# EAGLE design Main-v1.0 (EAGLE 8.3.0)
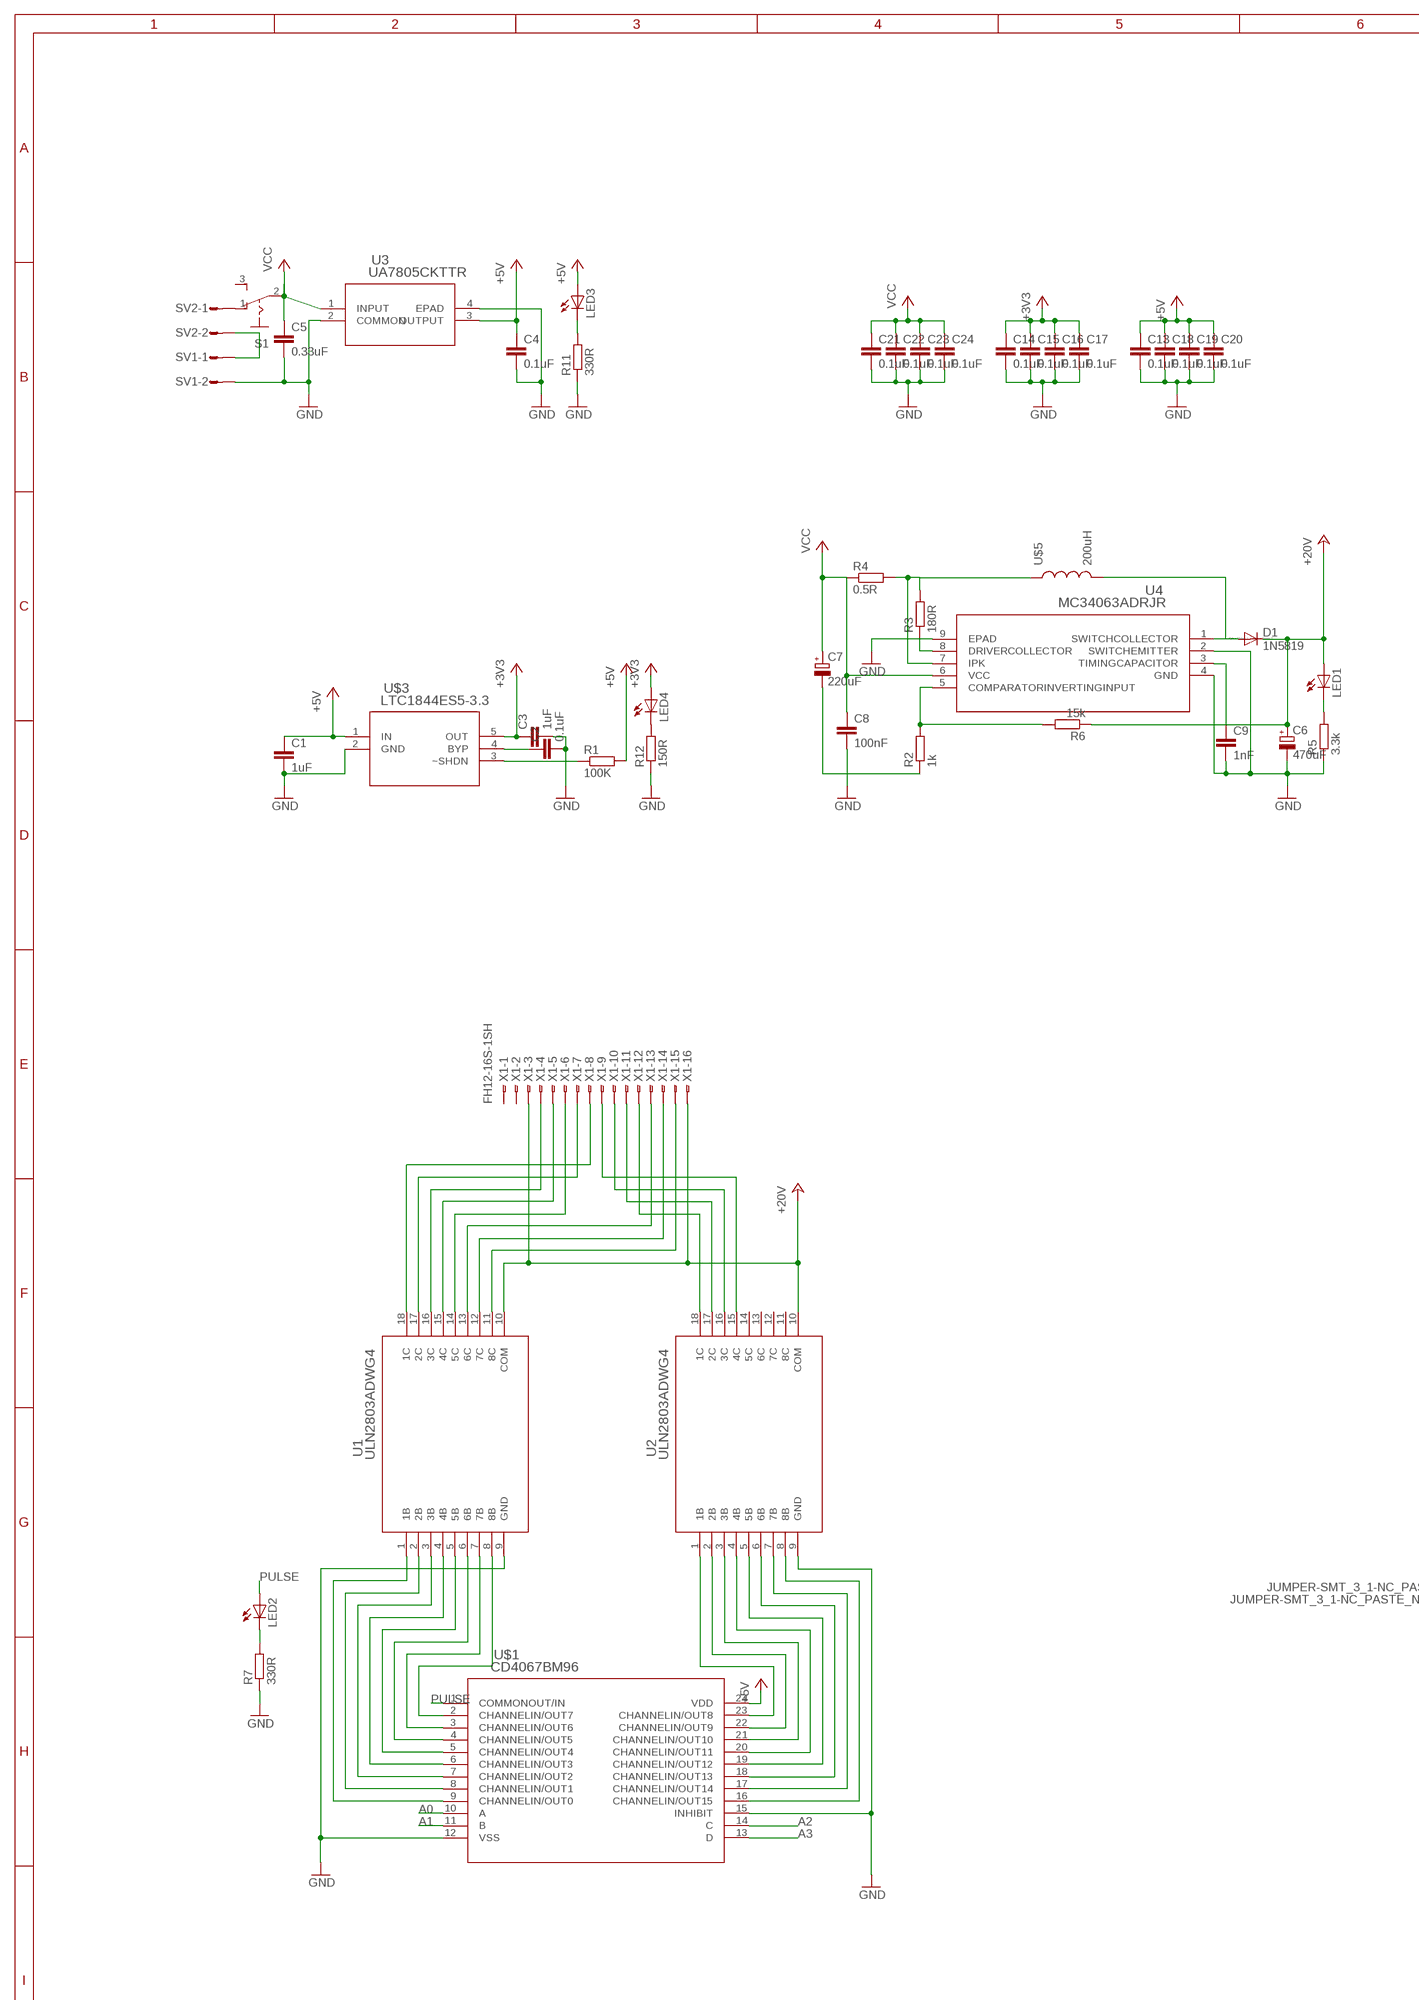
[diagram p0: schematic, sheet 1, part 1 of 2]
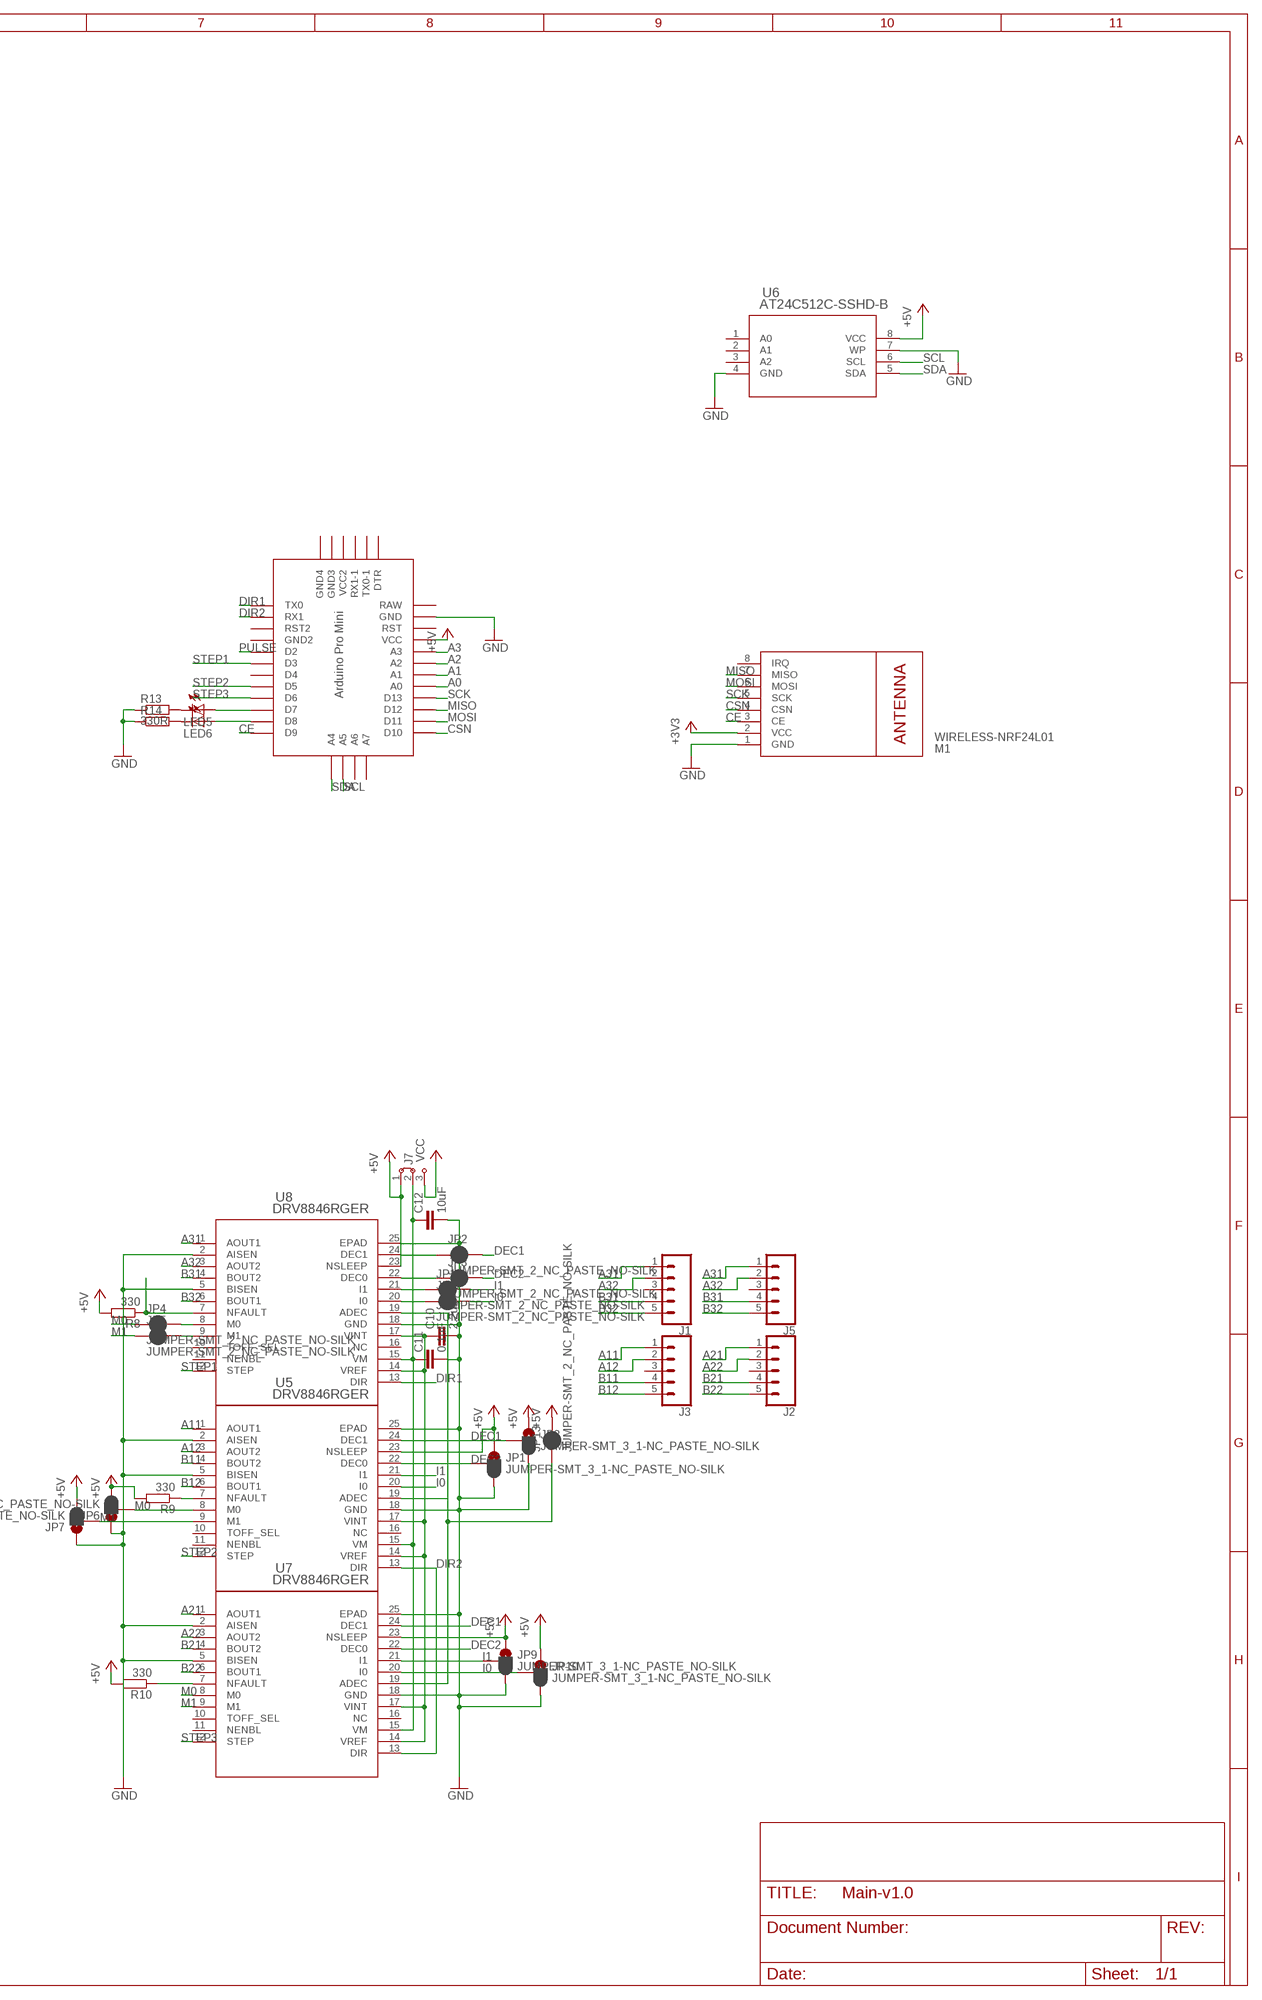
[diagram p1: schematic, sheet 1, part 2 of 2]

## Parts
C1  1uF  C-EUC0603  [C0603]
C2  0.1uF  C-EUC0603  [C0603]
C3  1uF  C-EUC0603  [C0603]
C4  0.1uF  C-EUC0603  [C0603]
C5  0.33uF  C-EUC0603  [C0603]
C6  470uF  CPOL-EU153CLV-1010  [153CLV-1010]
C7  220uF  CPOL-EUSMCC  [SMC_C]
C8  100nF  C-EUC0603  [C0603]
C9  1nF  C-EUC0603  [C0603]
C10  2.2uF  C-EUC0603  [C0603]
C11  0.1uF  C-EUC0603  [C0603]
C12  10uF  C-EUC0603  [C0603]
C13  0.1uF  C-EUC0603  [C0603]
C14  0.1uF  C-EUC0603  [C0603]
C15  0.1uF  C-EUC0603  [C0603]
C16  0.1uF  C-EUC0603  [C0603]
C17  0.1uF  C-EUC0603  [C0603]
C18  0.1uF  C-EUC0603  [C0603]
C19  0.1uF  C-EUC0603  [C0603]
C20  0.1uF  C-EUC0603  [C0603]
C21  0.1uF  C-EUC0603  [C0603]
C22  0.1uF  C-EUC0603  [C0603]
C23  0.1uF  C-EUC0603  [C0603]
C24  0.1uF  C-EUC0603  [C0603]
D1  1N5819  [SOD123]
J1  CONN_05JST-VERT  [JST-5-PTH-VERT]
J2  CONN_05JST-VERT  [JST-5-PTH-VERT]
J3  CONN_05JST-VERT  [JST-5-PTH-VERT]
J5  CONN_05JST-VERT  [JST-5-PTH-VERT]
J7  J2X2MM  [04C]
JP1  JUMPER-SMT_3_1-NC_PASTE_NO-SILK  [SMT-JUMPER_3_1-NC_PASTE_NO-SILK]
JP2  JUMPER-SMT_2_NC_PASTE_NO-SILK  [SMT-JUMPER_2_NC_PASTE_NO-SILK]
JP3  JUMPER-SMT_2_NC_PASTE_NO-SILK  [SMT-JUMPER_2_NC_PASTE_NO-SILK]
JP4  JUMPER-SMT_2_NC_PASTE_NO-SILK  [SMT-JUMPER_2_NC_PASTE_NO-SILK]
JP5  JUMPER-SMT_2_NC_PASTE_NO-SILK  [SMT-JUMPER_2_NC_PASTE_NO-SILK]
JP6  JUMPER-SMT_3_1-NC_PASTE_NO-SILK  [SMT-JUMPER_3_1-NC_PASTE_NO-SILK]
JP7  JUMPER-SMT_3_1-NC_PASTE_NO-SILK  [SMT-JUMPER_3_1-NC_PASTE_NO-SILK]
JP8  JUMPER-SMT_3_1-NC_PASTE_NO-SILK  [SMT-JUMPER_3_1-NC_PASTE_NO-SILK]
JP9  JUMPER-SMT_3_1-NC_PASTE_NO-SILK  [SMT-JUMPER_3_1-NC_PASTE_NO-SILK]
JP10  JUMPER-SMT_3_1-NC_PASTE_NO-SILK  [SMT-JUMPER_3_1-NC_PASTE_NO-SILK]
JP11  JUMPER-SMT_2_NC_PASTE_NO-SILK  [SMT-JUMPER_2_NC_PASTE_NO-SILK]
JP12  JUMPER-SMT_2_NC_PASTE_NO-SILK  [SMT-JUMPER_2_NC_PASTE_NO-SILK]
JP13  JUMPER-SMT_2_NC_PASTE_NO-SILK  [SMT-JUMPER_2_NC_PASTE_NO-SILK]
LED1  LEDSML0603  [SML0603]
LED2  LEDSML0603  [SML0603]
LED3  LEDSML0603  [SML0603]
LED4  LEDSML0603  [SML0603]
LED5  LEDSML0603  [SML0603]
LED6  LEDSML0603  [SML0603]
M1  WIRELESS-NRF24L01  [WIRELESS-NRF24L01]
R1  100K  R-EU_R0603  [R0603]
R2  1k  R-EU_R0603  [R0603]
R3  180R  R-EU_R0603  [R0603]
R4  0.5R  R-EU_R0603  [R0603]
R5  3.3k  R-EU_R0603  [R0603]
R6  15k  R-EU_R0603  [R0603]
R7  330R  R-EU_R0603  [R0603]
R8  330  R-EU_R0603  [R0603]
R9  330  R-EU_R0603  [R0603]
R10  330  R-EU_R0603  [R0603]
R11  330R  R-EU_R0603  [R0603]
R12  150R  R-EU_R0603  [R0603]
R13  330R  R-EU_R0603  [R0603]
R14  R-EU_R0603  [R0603]
S1  255SB  [255SB]
SV1  L02P  [L02P]
SV2  L02P  [L02P]
U1  ULN2803ADWG4  [DW18]
U2  ULN2803ADWG4  [DW18]
U3  UA7805CKTTR  [KTT3_6P22X6P6]
U4  MC34063ADRJR  [DRJ8_2P2X3]
U5  DRV8846RGER  [RGE24_2P45X2P45]
U6  AT24C512C-SSHD-B  [8S1]
U7  DRV8846RGER  [RGE24_2P45X2P45]
U8  DRV8846RGER  [RGE24_2P45X2P45]
U$1  CD4067BM96  [DW24]
U$2  PRO-MINI  [PRO-MINI]
U$3  LTC1844ES5-3.3  [TSOT-23_S5]
U$5  200uH  INDUCTORCR54  [CR54]
X1  FH12-16S-1SH  [FH12-16S-1SH]

## Nets
+3V3: C3.1 C14.1 C15.1 C16.1 C17.1 LED4.A M1.2(VCC) U$3.5(OUT)
+5V: C1.1 C4.1 C13.1 C18.1 C19.1 C20.1 J7.1 JP1.1 JP6.3 JP7.3 JP8.1 JP9.1 JP10.1 JP13.2 LED3.A R1.2 R8.2 R9.2 R10.2 U3.3(OUTPUT) U5.23(NSLEEP) U6.8(VCC) U7.23(NSLEEP) U8.23(NSLEEP) U$1.24(VDD) U$2.VCC U$3.1(IN)
+24V: C6.+ D1.C LED1.A R6.1 U1.10(COM) U2.10(COM) X1.3 X1.16 ; supply symbol labelled +20V
A0: U$1.10(A) U$2.A0
A1: U$1.11(B) U$2.A1
A2: U$1.14(C) U$2.A2
A3: U$1.13(D) U$2.A3
A11: J3.1 U5.1(AOUT1)
A12: J3.2 U5.3(AOUT2)
A21: J2.1 U7.1(AOUT1)
A22: J2.2 U7.3(AOUT2)
A31: J1.1 J5.1 U8.1(AOUT1)
A32: J1.2 J5.2 U8.3(AOUT2)
B11: J3.4 U5.4(BOUT2)
B12: J3.5 U5.6(BOUT1)
B21: J2.4 U7.4(BOUT2)
B22: J2.5 U7.6(BOUT1)
B31: J1.4 J5.4 U8.4(BOUT2)
B32: J1.5 J5.5 U8.6(BOUT1)
CE: M1.3(CE) U$2.D9
CSN: M1.4(CSN) U$2.D10
DEC1: JP2.2 JP8.2 U5.24(DEC1) U7.24(DEC1)
DEC2: JP1.2 JP3.2 U5.22(DEC0) U7.22(DEC0)
DIR1: U8.13(DIR) U$2.TX0
DIR2: U5.13(DIR) U7.13(DIR) U$2.RX1
GND: C1.2 C2.2 C3.2 C4.2 C5.2 C6.- C7.- C8.2 C9.2 C10.2 C11.2 C12.2 C13.2 C14.2 C15.2 C16.2 C17.2 C18.2 C19.2 C20.2 C21.2 C22.2 C23.2 C24.2 JP1.3 JP6.1 JP7.1 JP8.3 JP9.3 JP10.3 M1.1(GND) R2.1 R5.1 R7.1 R11.1 R12.1 R13.1 R14.1 SV1.2 U1.9(GND) U2.9(GND) U3.2(COMMON) U3.4(EPAD) U4.2(SWITCHEMITTER) U4.4(GND) U4.9(EPAD) U5.2(AISEN) U5.5(BISEN) U5.18(GND) U5.25(EPAD) U6.4(GND) U6.7(WP) U7.2(AISEN) U7.5(BISEN) U7.18(GND) U7.25(EPAD) U8.2(AISEN) U8.5(BISEN) U8.18(GND) U8.25(EPAD) U$1.12(VSS) U$1.15(INHIBIT) U$2.GND U$3.2(GND)
I0: JP10.2 JP12.2 U5.20(I0) U7.20(I0)
I1: JP9.2 JP11.2 U5.21(I1) U7.21(I1)
M0: JP4.1 JP6.2 U5.8(M0) U7.8(M0)
M1: JP5.1 JP7.2 U5.9(M1) U7.9(M1)
MISO: M1.7(MISO) U$2.D12
MOSI: M1.6(MOSI) U$2.D11
N$1: SV1.1 SV2.2
N$2: R8.1 U8.7(NFAULT)
N$3: U1.8(8B) U$1.2(CHANNELIN/OUT7)
N$4: U1.7(7B) U$1.3(CHANNELIN/OUT6)
N$5: U1.6(6B) U$1.4(CHANNELIN/OUT5)
N$6: U1.5(5B) U$1.5(CHANNELIN/OUT4)
N$7: U1.4(4B) U$1.6(CHANNELIN/OUT3)
N$8: U1.3(3B) U$1.7(CHANNELIN/OUT2)
N$9: U1.2(2B) U$1.8(CHANNELIN/OUT1)
N$10: U1.1(1B) U$1.9(CHANNELIN/OUT0)
N$11: U2.1(1B) U$1.23(CHANNELIN/OUT8)
N$12: U2.2(2B) U$1.22(CHANNELIN/OUT9)
N$13: U2.3(3B) U$1.21(CHANNELIN/OUT10)
N$14: U2.4(4B) U$1.20(CHANNELIN/OUT11)
N$15: U2.5(5B) U$1.19(CHANNELIN/OUT12)
N$16: U2.6(6B) U$1.18(CHANNELIN/OUT13)
N$17: R3.1 U4.8(DRIVERCOLLECTOR)
N$18: R2.2 R6.2 U4.5(COMPARATORINVERTINGINPUT)
N$19: JP3.1 U8.22(DEC0)
N$20: C10.1 U5.14(VREF) U5.17(VINT) U7.14(VREF) U7.17(VINT) U8.14(VREF) U8.17(VINT)
N$21: U1.11(8C) X1.15
N$22: U1.12(7C) X1.14
N$23: U1.13(6C) X1.13
N$24: U1.14(5C) X1.6
N$25: U1.15(4C) X1.5
N$26: U1.16(3C) X1.4
N$27: U1.17(2C) X1.7
N$28: U1.18(1C) X1.8
N$29: U2.8(8B) U$1.16(CHANNELIN/OUT15)
N$30: U2.18(1C) X1.12
N$31: U2.17(2C) X1.11
N$32: U2.16(3C) X1.10
N$33: U2.15(4C) X1.9
N$34: U2.7(7B) U$1.17(CHANNELIN/OUT14)
N$35: C11.1 C12.1 J7.2 U5.15(VM) U7.15(VM) U8.15(VM)
N$36: R3.2 R4.2 U4.7(IPK) U$5.P$1
N$37: S1.1(O) SV2.1
N$38: C2.1 U$3.4(BYP)
N$39: R1.1 U$3.3(~SHDN)
N$40: JP4.2 U8.8(M0)
N$41: C9.1 U4.3(TIMINGCAPACITOR)
N$42: JP5.2 U8.9(M1)
N$43: D1.A U4.1(SWITCHCOLLECTOR) U$5.P$2
N$44: LED1.C R5.2
N$45: LED2.C R7.2
N$46: R9.1 U5.7(NFAULT)
N$47: JP2.1 U8.24(DEC1)
N$48: R10.1 U7.7(NFAULT)
N$49: JP13.1 U5.19(ADEC) U7.19(ADEC) U8.19(ADEC)
N$50: LED3.C R11.2
N$51: LED4.C R12.2
N$52: LED5.C R13.2
N$53: JP12.1 U8.20(I0)
N$54: JP11.1 U8.21(I1)
N$55: LED6.C R14.2
N$56: LED5.A U$2.D7
N$57: LED6.A U$2.D8
PULSE: LED2.A U$1.1(COMMONOUT/IN) U$2.D2
SCK: M1.5(SCK) U$2.D13
SCL: U6.6(SCL) U$2.A5
SDA: U6.5(SDA) U$2.A4
STEP1: U8.12(STEP) U$2.D3
STEP2: U5.12(STEP) U$2.D5
STEP3: U7.12(STEP) U$2.D6
VCC: C5.1 C7.+ C8.1 C21.1 C22.1 C23.1 C24.1 J7.3 R4.1 S1.2(P) U3.1(INPUT) U4.6(VCC)
Unconnected: J1.3 J2.3 J3.3 J5.3 M1.8(IRQ) S1.3(S) U2.11(8C) U2.12(7C) U2.13(6C) U2.14(5C) U5.10(TOFF_SEL) U5.11(NENBL) U5.16(NC) U6.1(A0) U6.2(A1) U6.3(A2) U7.10(TOFF_SEL) U7.11(NENBL) U7.16(NC) U8.10(TOFF_SEL) U8.11(NENBL) U8.16(NC) U$2.A6 U$2.A7 U$2.D4 U$2.DTR U$2.GND1(GND2) U$2.GND2(GND4) U$2.GND3 U$2.RST U$2.RST1(RST2) U$2.RX1-1 U$2.TX0-1 U$2.VCC1(VCC2) X1.1 X1.2

## Power pins joined to a net without a drawn wire
RAW: U$2.RAW

## Library data of the parts
C1-C5 C10-C24 = resistor:C-EU: CAPACITOR, European symbol
C6 = resistor:CPOL-EU: POLARIZED CAPACITOR, European symbol
C7 = rcl:CPOL-EU: POLARIZED CAPACITOR, European symbol
C8 C9 = rcl:C-EU: CAPACITOR, European symbol
D1 = Beeclust:1N5819: SCHOTTKY BARRIER RECTIFIER Source: http://onsemi.com .. MBR0520LT1-D.pdf
J1-J3 J5 = SparkFun-Connectors:CONN_05: Multi connection point. Often used as Generic Header-pin footprint for 0.1 inch spaced/style header connections On any of the 0.1 inch spaced packages, you can populate with these: Break Away Headers - Straight <https://www.sparkfun.com/products/116> (PRT-00116) Break Away Male Headers - Right Angle <https://www.sparkfun.com/products/553> (PRT-00553) Female Headers <https://www.sparkfun.com/products/115> (PRT-00115) Break Away Headers - Machine Pin <https://www.sparkfun.com/products/117> (PRT-00117) Break Away Female Headers - Swiss Machine Pin <https://www.sparkfun.com/products/743> (PRT-00743) For SCREWTERMINALS and SPRING TERMINALS visit here: Screw Terimnals on SparkFun.com <https://www.sparkfun.com/search/results?term=Screw+Terminals> (5mm/3.5mm/2.54mm spacing) This device is also useful as a general connection point to wire up your design to another part of your project. Our various solder wires solder well into these plated through hole pads. Hook-Up Wire - Assortment (Stranded, 22 AWG) <https://www.sparkfun.com/products/11375> (PRT-11375) Hook-Up Wire - Assortment (Solid Core, 22 AWG) <https://www.sparkfun.com/products/11367> (PRT-11367) View the entire wire category on our website here <https://www.sparkfun.com/categories/141> Special notes: Molex polarized connector foot print use with SKU : PRT-08231 with associated crimp pins and housings. 1MM SMD Version SKU: PRT-10208
J7 = jumper:J2: Jumper switch 2 x 2.5 mm
JP1 JP6-JP10 = SparkFun-Jumpers:JUMPER-SMT_3_1-NC_PASTE: Normally closed solder jumper (1 of 2 connections) This jumper has an aperture in the stencil to allow solder paste to bridge one of the two connections. One connection is normally closed (NC), while the other is normally open (NO). Wick off the solder to open the connection. Reapply solder to reclose the connection. Apply solder to the other side instead to change the current path.
JP2-JP5 JP11-JP13 = SparkFun-Jumpers:JUMPER-SMT_2_NC_PASTE: Normally closed solder jumper This jumper has an aperture in the stencil to allow solder paste to bridge the split in the wire so it's normally closed (NC). Wick off the solder to open the connection. Reapply solder to reclose the connection.
LED1-LED6 = led:LED: LED OSRAM: - CHIPLED LG R971, LG N971, LY N971, LG Q971, LY Q971, LO R971, LY R971 LH N974, LH R974 LS Q976, LO Q976, LY Q976 LO Q996 - Hyper CHIPLED LW Q18S LB Q993, LB Q99A, LB R99A - SideLED LS A670, LO A670, LY A670, LG A670, LP A670 LB A673, LV A673, LT A673, LW A673 LH A674 LY A675 LS A676, LA A676, LO A676, LY A676, LW A676 LS A679, LY A679, LG A679 - Hyper Micro SIDELED® LS Y876, LA Y876, LO Y876, LY Y876 LT Y87S - SmartLED LW L88C, LW L88S LB L89C, LB L89S, LG L890 LS L89K, LO L89K, LY L89K LS L896, LA L896, LO L896, LY L896 - TOPLED LS T670, LO T670, LY T670, LG T670, LP T670 LSG T670, LSP T670, LSY T670, LOP T670, LYG T670 LG T671, LOG T671, LSG T671 LB T673, LV T673, LT T673, LW T673 LH T674 LS T676, LA T676, LO T676, LY T676, LB T676, LH T676, LSB T676, LW T676 LB T67C, LV T67C, LT T67C, LS T67K, LO T67K, LY T67K, LW E67C LS E67B, LA E67B, LO E67B, LY E67B, LB E67C, LV E67C, LT E67C LW T67C LS T679, LY T679, LG T679 LS T770, LO T770, LY T770, LG T770, LP T770 LB T773, LV T773, LT T773, LW T773 LH T774 LS E675, LA E675, LY E675, LS T675 LS T776, LA T776, LO T776, LY T776, LB T776 LHGB T686 LT T68C, LB T68C - Hyper Mini TOPLED® LB M676 - Mini TOPLED Santana® LG M470 LS M47K, LO M47K, LY M47K Source: http://www.osram.convergy.de LUXEON: - LUMILED® LXK2-PW12-R00, LXK2-PW12-S00, LXK2-PW14-U00, LXK2-PW14-V00 LXK2-PM12-R00, LXK2-PM12-S00, LXK2-PM14-U00 LXK2-PE12-Q00, LXK2-PE12-R00, LXK2-PE12-S00, LXK2-PE14-T00, LXK2-PE14-U00 LXK2-PB12-K00, LXK2-PB12-L00, LXK2-PB12-M00, LXK2-PB14-N00, LXK2-PB14-P00, LXK2-PB14-Q00 LXK2-PR12-L00, LXK2-PR12-M00, LXK2-PR14-Q00, LXK2-PR14-R00 LXK2-PD12-Q00, LXK2-PD12-R00, LXK2-PD12-S00 LXK2-PH12-R00, LXK2-PH12-S00 LXK2-PL12-P00, LXK2-PL12-Q00, LXK2-PL12-R00 Source: www.luxeon.com KINGBRIGHT: KA-3528ASYC Source: www.kingbright.com
M1 = diy-modules:WIRELESS-NRF24L01: 2.4 GHz Wireless Module based on NRF24L01 chip More details available here: http://www.electrodragon.com/w/NRF24L01 Click here to find device on ebay.com <http://www.ebay.com/sch/nrf24l01+arduino>
R1-R14 = resistor:R-EU_: RESISTOR, European symbol
S1 = switch:255SB: SLIDING SWITCH Distributor Buerklin, 11G810
SV1 SV2 = con-amp-mt:L02P: AMP MT CONNECTOR; OC_FARNELL: unknown; OC_NEWARK: unknown
U1 U2 = Beeclust:ULN2803ADWG4; MANUFACTURER_PART_NUMBER: ULN2803ADWG4; VENDOR: Texas Instruments
U3 = Beeclust:UA7805CKTTR; MANUFACTURER_PART_NUMBER: UA7805CKTTR; VENDOR: Texas Instruments
U4 = Beeclust:MC34063ADRJR; MANUFACTURER_PART_NUMBER: MC34063ADRJR; VENDOR: Vendor
U5 U7 U8 = Beeclust:DRV8846RGER; MANUFACTURER_PART_NUMBER: drv8846rger; VENDOR: Texas Instruments
U6 = Beeclust:AT24C512C-SSHD-B; MANUFACTURER_PART_NUMBER: AT24C512CSSHDB; VENDOR: ATMEL
U$1 = Beeclust:CD4067BM96; MANUFACTURER_PART_NUMBER: CD4067B_DW_24; VENDOR: Texas Instruments
U$2 = Arduino-clone:PRO-MINI: Arduion Pro Mini Clone V1.0 www.betemcu.cu
U$3 = Beeclust:LTC1844ES5-3.3
U$5 = adjacent-reality:INDUCTOR: Inductors Basic Inductor/Choke - 0603 and 1206. Footprints are not proven and vary greatly between part numbers. CC-BY-SA from SparkFun
X1 = con-hirose:FH12-16S-1S: 1mm Pitch Connectors For FPC/FFC Source: Data sheet <http://www.hirose.co.jp/cataloge_hp/e58605370.pdf>; OC_FARNELL: unknown; OC_NEWARK: unknown

## Board
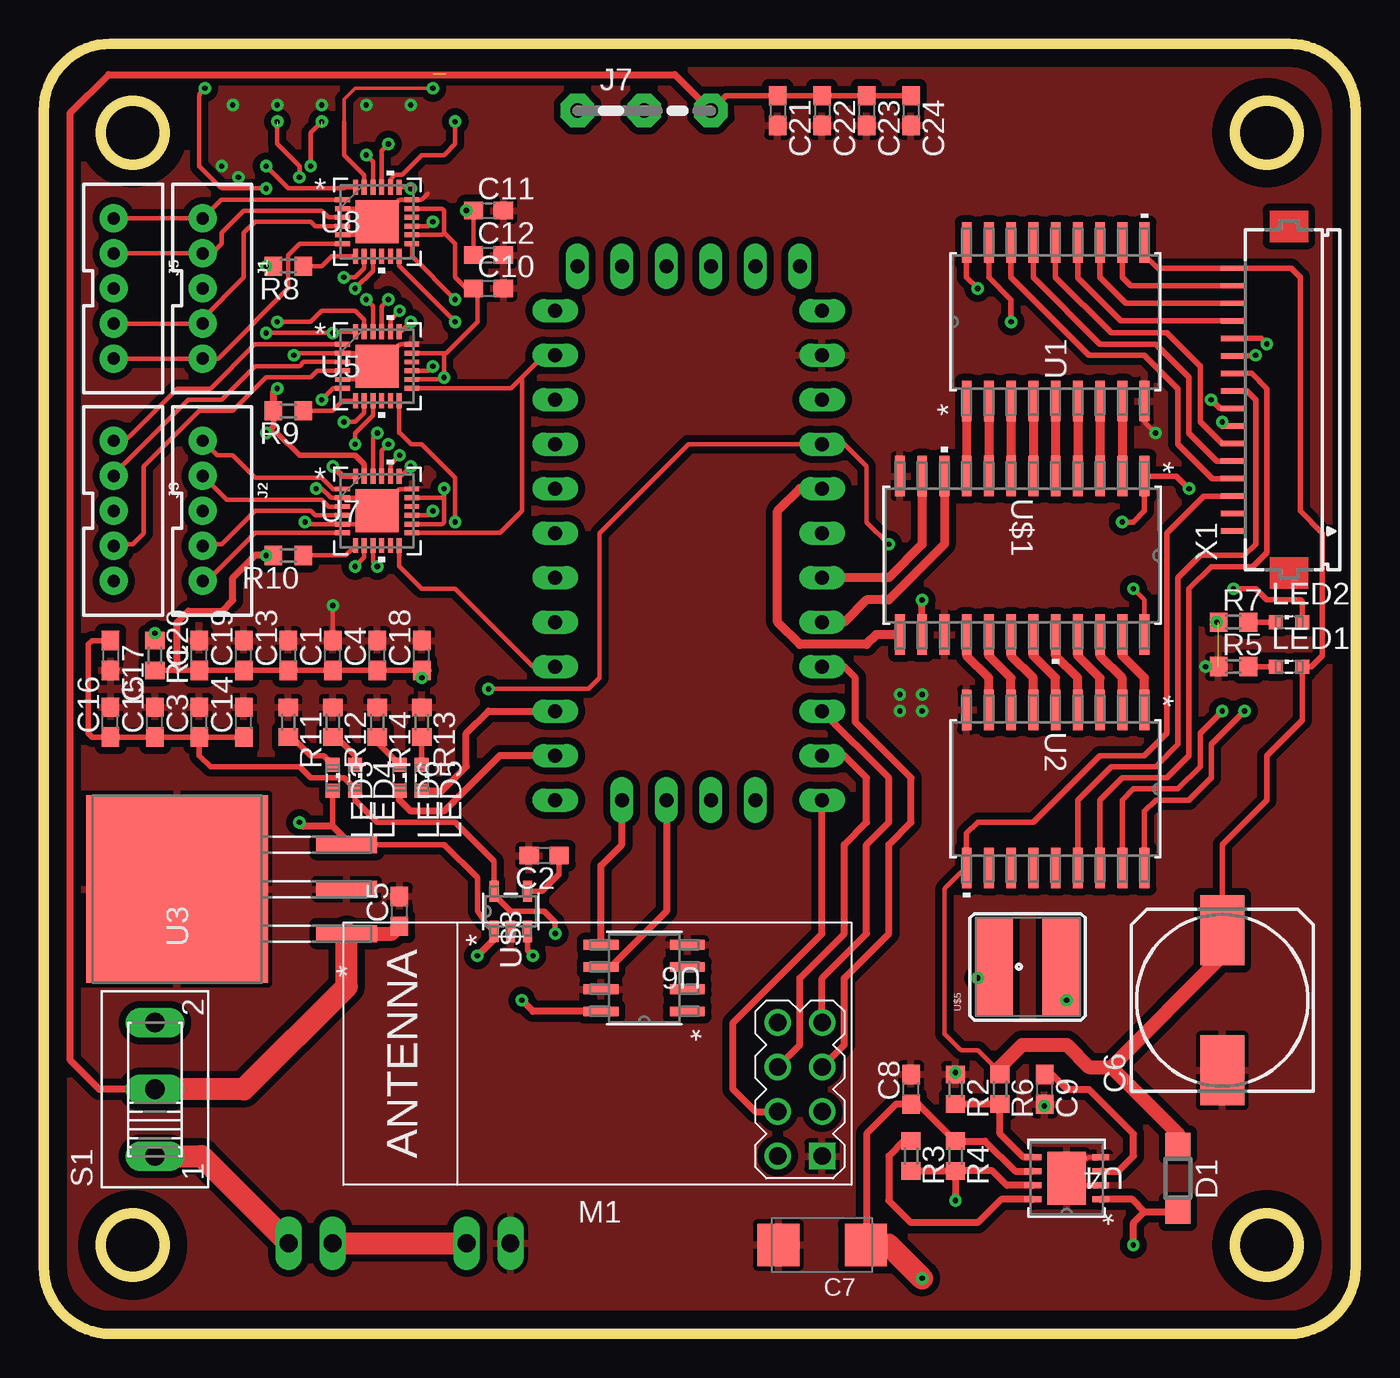
[diagram p2: board, top side]
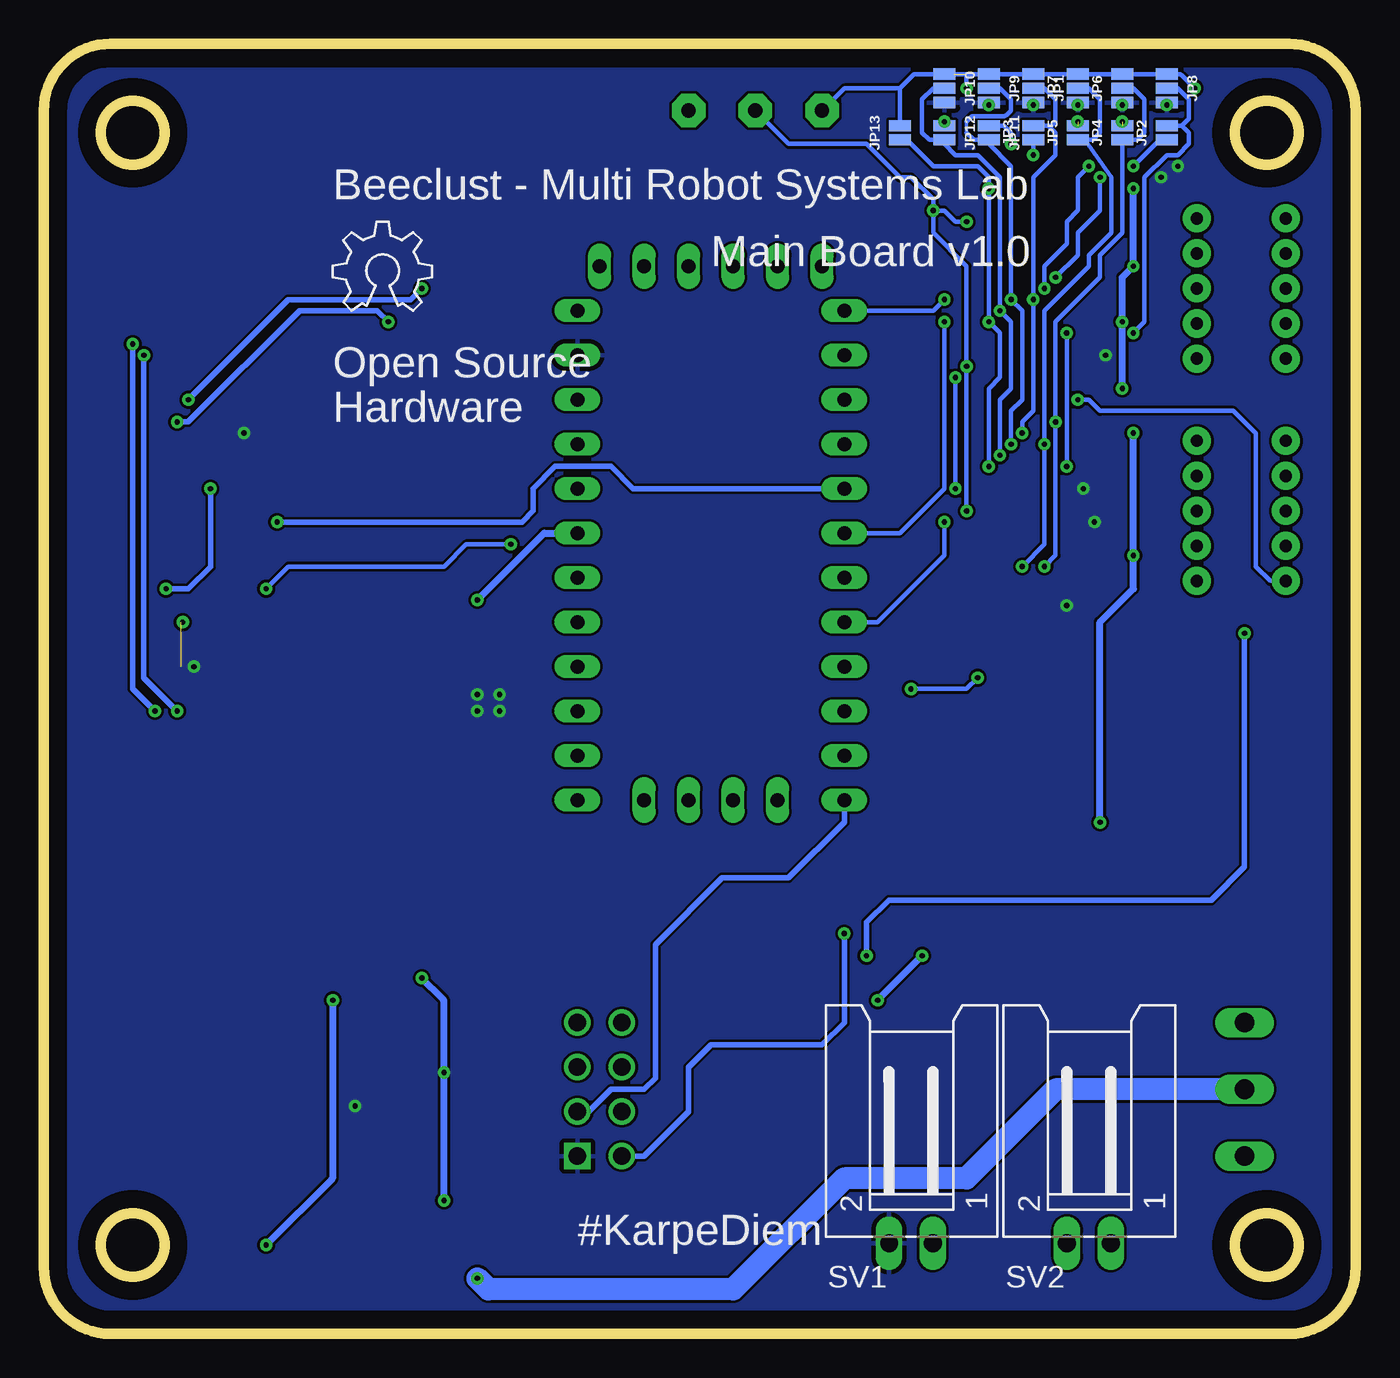
[diagram p3: board, bottom side, seen from below]

Size 74.93 x 73.66 mm. Coordinates in mm from the lower left corner, seen from the top.
Outline: 0,3.81 arc90 3.81,0 71.12,0 arc90 74.93,3.81 74.93,69.85 arc90 71.12,73.66 3.81,73.66 arc90 0,69.85 0,3.81
Outline: circle at 69.85,68.58 radius 1.8
Outline: circle at 5.08,68.58 radius 1.8
Outline: circle at 5.08,5.08 radius 1.8
Outline: circle at 69.85,5.08 radius 1.8
Copper layers (1*16): Top 0.035mm / dielectric 1.5mm / Bottom 0.035mm
Design rules "default": minimum track width 6mil, minimum drill 0.35mm, track to track 6mil, track to pad 6mil, pad to pad 6mil, via to via 6mil, smd to smd 6mil, copper to edge 40mil, drill to drill 6mil, minimum pad ring 10mil, minimum via ring 8mil, stop-mask expansion 4mil, vias tented up to drill 0mil, thermal gap 10mil

### Footprints (pad centres in the part's own frame; a part is rotated, then mirrored left to right if it is on the bottom)
C0603 = smd 1.1 x 1: 1 -0.85,0; 2 0.85,0
153CLV-1010 = smd 4 x 2.5: + 4,0; - -4,0
SMC_C = smd 2.4 x 2.4: + -2.5,0; - 2.5,0
SOD123 = smd 1.4 x 1.4: A 1.9,0; C -1.9,0
JST-5-PTH-VERT = drill 0.7 pad 1.6: 1 -4,0.18; 2 -2,0.18; 3 0,0.18; 4 2,0.18; 5 4,0.18
04C = drill 0.813 pad 1.905 octagon: 1 -1.905,0; 2 1.905,0; 3 5.715,0
SMT-JUMPER_3_1-NC_PASTE_NO-SILK = smd 0.635 x 1.27: 1 -0.813,0; 2 0,0; 3 0.813,0
SMT-JUMPER_2_NC_PASTE_NO-SILK = smd 0.635 x 1.27: 1 -0.406,0; 2 0.406,0
SML0603 = smd 0.8 x 0.8: A 0.75,0; C -0.75,0
WIRELESS-NRF24L01 = drill 1 square: 1 -12.7,6.35 | drill 1: 2 -10.16,6.35; 3 -12.7,3.81; 4 -10.16,3.81; 5 -12.7,1.27; 6 -10.16,1.27; 7 -12.7,-1.27; 8 -10.16,-1.27
R0603 = smd 1 x 1.1: 1 -0.85,0; 2 0.85,0
255SB = drill 1.118 long: 1 -3.81,0; 2 0,0; 3 3.81,0
L02P = drill 1.016 long: 1 1.25,-6.25; 2 -1.25,-6.25
DW18 = smd 2.311 x 0.559: 1 -4.521,5.08; 2 -4.521,3.81; 3 -4.521,2.54; 4 -4.521,1.27; 5 -4.521,0; 6 -4.521,-1.27; 7 -4.521,-2.54; 8 -4.521,-3.81; 9 -4.521,-5.08; 10 4.521,-5.08; 11 4.521,-3.81; 12 4.521,-2.54; 13 4.521,-1.27; 14 4.521,0; 15 4.521,1.27; 16 4.521,2.54; 17 4.521,3.81; 18 4.521,5.08
KTT3_6P22X6P6 = smd 0.965 x 3.505: 1 -2.54,-9.677; 2 0,-9.677; 3 2.54,-9.677 | smd 10.719 x 10.363: 4 0,0
DRJ8_2P2X3 = smd 0.95 x 0.35: 1 -1.93,1.2; 2 -1.93,0.4; 3 -1.93,-0.4; 4 -1.93,-1.2; 5 1.93,-1.2; 6 1.93,-0.4; 7 1.93,0.4; 8 1.93,1.2 | smd 2.2 x 3: 9 0,0
RGE24_2P45X2P45 = smd 0.85 x 0.28: 1 -1.975,1.25; 2 -1.975,0.75; 3 -1.975,0.25; 4 -1.975,-0.25; 5 -1.975,-0.75; 6 -1.975,-1.25; 13 1.975,-1.25; 14 1.975,-0.75; 15 1.975,-0.25; 16 1.975,0.25; 17 1.975,0.75; 18 1.975,1.25 | smd 0.28 x 0.85: 7 -1.25,-1.975; 8 -0.75,-1.975; 9 -0.25,-1.975; 10 0.25,-1.975; 11 0.75,-1.975; 12 1.25,-1.975; 19 1.25,1.975; 20 0.75,1.975; 21 0.25,1.975; 22 -0.25,1.975; 23 -0.75,1.975; 24 -1.25,1.975 | smd 2.45 x 2.45: 25 0,0
8S1 = smd 1.981 x 0.561: 1 -2.465,1.905; 2 -2.465,0.635; 3 -2.465,-0.635; 4 -2.465,-1.905; 5 2.465,-1.905; 6 2.465,-0.635; 7 2.465,0.635; 8 2.465,1.905
DW24 = smd 2.311 x 0.559: 1 -4.521,6.985; 2 -4.521,5.715; 3 -4.521,4.445; 4 -4.521,3.175; 5 -4.521,1.905; 6 -4.521,0.635; 7 -4.521,-0.635; 8 -4.521,-1.905; 9 -4.521,-3.175; 10 -4.521,-4.445; 11 -4.521,-5.715; 12 -4.521,-6.985; 13 4.521,-6.985; 14 4.521,-5.715; 15 4.521,-4.445; 16 4.521,-3.175; 17 4.521,-1.905; 18 4.521,-0.635; 19 4.521,0.635; 20 4.521,1.905; 21 4.521,3.175; 22 4.521,4.445; 23 4.521,5.715; 24 4.521,6.985
PRO-MINI = drill 0.8 long: A0 8.89,8.89; A1 8.89,11.43; A2 8.89,13.97; A3 8.89,16.51; A4 -2.54,-1.27; A5 0,-1.27; A6 2.54,-1.27; A7 5.08,-1.27; D2 -6.35,16.51; D3 -6.35,13.97; D4 -6.35,11.43; D5 -6.35,8.89; D6 -6.35,6.35; D7 -6.35,3.81; D8 -6.35,1.27; D9 -6.35,-1.27; D10 8.89,-1.27; D11 8.89,1.27; D12 8.89,3.81; D13 8.89,6.35; DTR 7.62,29.21; GND 8.89,24.13; GND1 -6.35,19.05; GND2 -5.08,29.21; GND3 -2.54,29.21; RAW 8.89,26.67; RST 8.89,21.59; RST1 -6.35,21.59; RX1 -6.35,24.13; RX1-1 2.54,29.21; TX0 -6.35,26.67; TX0-1 5.08,29.21; VCC 8.89,19.05; VCC1 0,29.21
TSOT-23_S5 = smd 1.219 x 0.508: 1 -1.143,0.95; 2 -1.143,0; 3 -1.143,-0.95; 4 1.143,-0.95; 5 1.143,0.95
CR54 = smd 5.5 x 2.15: P$1 0,1.92; P$2 0,-1.92
FH12-16S-1SH = smd 0.3 x 1.3: 1 -7.5,3.25; 2 -6.5,3.25; 3 -5.5,3.25; 4 -4.5,3.25; 5 -3.5,3.25; 6 -2.5,3.25; 7 -1.5,3.25; 8 -0.5,3.25; 9 0.5,3.25; 10 1.5,3.25; 11 2.5,3.25; 12 3.5,3.25; 13 4.5,3.25; 14 5.5,3.25; 15 6.5,3.25; 16 7.5,3.25

### Placement (x,y rotation side)
C1  16.51,38.73 90 top
C2  28.57,27.3 180 top
C3  8.89,34.92 90 top
C4  19.05,38.73 90 top
C5  20.32,24.13 90 top
C6  67.31,19.05 90 top
C7  44.45,5.08 180 top
C8  49.53,13.97 90 top
C9  57.15,13.97 270 top
C10  25.4,59.69 0 top
C11  25.4,64.14 0 top
C12  25.4,61.59 0 top
C13  13.97,38.73 90 top
C14  11.43,34.92 90 top
C15  6.35,34.92 90 top
C16  3.81,34.92 90 top
C17  3.81,38.73 270 top
C18  21.59,38.73 90 top
C19  11.43,38.73 90 top
C20  8.89,38.73 90 top
C21  41.91,69.85 270 top
C22  44.45,69.85 270 top
C23  46.99,69.85 270 top
C24  49.53,69.85 270 top
D1  64.77,8.89 270 top
J1  8.89,59.69 270 top
J2  8.89,46.99 270 top
J3  3.81,46.99 270 top
J5  3.81,59.69 270 top
J7  32.38,69.85 0 top
JP1  18.41,71.12 270 bottom
JP2  10.79,68.58 90 bottom
JP3  18.41,68.58 90 bottom
JP4  13.34,68.58 90 bottom
JP5  15.88,68.58 90 bottom
JP6  13.34,71.12 90 bottom
JP7  15.88,71.12 90 bottom
JP8  10.79,71.12 270 bottom
JP9  20.95,71.12 270 bottom
JP10  23.5,71.12 270 bottom
JP11  20.95,68.58 270 bottom
JP12  23.5,68.58 270 bottom
JP13  26.04,68.58 90 bottom
LED1  71.12,38.1 0 top
LED2  71.12,40.64 0 top
LED3  16.51,31.75 270 top
LED4  17.78,31.75 270 top
LED5  21.59,31.75 270 top
LED6  20.32,31.75 270 top
M1  31.75,16.51 180 top
R1  6.35,38.73 270 top
R2  52.07,13.97 270 top
R3  49.53,10.16 270 top
R4  52.07,10.16 270 top
R5  67.94,38.1 0 top
R6  54.61,13.97 270 top
R7  67.94,40.64 0 top
R8  13.97,60.96 180 top
R9  13.97,52.7 180 top
R10  13.97,44.45 180 top
R11  13.97,34.92 270 top
R12  16.51,34.92 270 top
R13  21.59,34.92 270 top
R14  19.05,34.92 270 top
S1  6.35,13.97 90 top
SV1  25.4,11.43 0 bottom
SV2  15.24,11.43 0 bottom
U1  57.78,57.78 90 top
U2  57.78,31.11 270 top
U3  7.62,25.4 90 top
U4  58.42,8.89 180 top
U5  19.05,55.24 0 top
U6  34.29,20.32 180 top
U7  19.05,46.99 0 top
U8  19.05,63.5 0 top
U$1  55.88,44.45 270 top
U$2  35.56,31.75 0 top
U$3  26.67,24.13 90 top
U$4  [OSHW_6X200_NOTEXT]  58.42,58.42 0 bottom
U$5  56.2,20.96 90 top
X1  71.12,53.34 90 top

### Tracks (layer width: path | path; a pad name or v marks a point on that pad's centre or on a via)
+3V3  (via drill 0.3)
  Top 0.305: v29.21,22.86 29.21,23.5 28.57,24.13 26.67,24.13 25.72,25.08 U$3.5 25.72,26.98 23.5,29.21 19.05,29.21 17.78,30.48 LED4.A 17.78,31.11 17.15,31.75 17.14,31.75 15.24,31.75 14.61,32.38 9.53,32.38 8.89,33.02 8.89,34.04 | 8.89,34.04 C3.1 C14.1 | 8.89,34.04 8.86,34.07 C15.1 C16.1 2.75,34.07 2.54,34.29 2.54,39.37 2.75,39.58 C17.1
  Bottom 0.305: v29.21,22.86 29.21,17.78 30.48,16.51 36.83,16.51 38.1,15.24 38.1,12.7 40.64,10.16 M1.2
+5V  (via drill 0.3)  (1 unrouted)
  Top 0.203: v22.23,71.12 17.78,71.12 17.14,70.48 17.14,69.22
  Top 0.254: U5.23 18.3,57.9 17.78,58.42 15.88,58.42 15.24,57.78 v13.34,57.78 | U8.23 18.3,66.16 17.14,67.31 17.14,69.22 | v25.4,36.83 31.11,36.83 31.75,37.46 31.75,45.72 36.83,50.8 U$2.VCC 45.72,50.8 46.99,49.53 46.99,46.35 v48.26,45.08 | C18.1 v21.59,37.46 | U$1.24 62.87,41.91 v62.23,42.54 | v9.21,71.12 8.96,70.88 arc45 8.89,70.7 8.89,66.67 10.09,65.48 arc45 10.27,65.41 v12.7,65.41
  Top 0.305: U3.3 22.86,27.94 24.77,26.04 24.77,24.13 25.21,23.5 U$3.1 25.72,23.18 | R1.2 7.62,37.88 C20.1 C19.1 C13.1 C1.1 C4.1 C18.1 22.01,37.88 | 16.51,28.98 LED3.A | U7.23 18.3,49.64 17.78,50.16 14.61,50.16 13.34,51.43 12.73,51.43 | 12.73,51.43 v12.7,51.43 | R9.2 13.12,51.83 12.73,51.43
  Top 0.406: U6.8 27.94,18.41 v27.3,19.05 | U$3.1 25.72,22.55 v24.77,21.59 | R10.2 v12.7,44.45 12.06,44.45 10.79,43.18 10.79,41.89 10.18,41.27 8.26,41.27 7.62,40.64 7.62,37.88 | U3.3 17.3,28.2 16.51,28.98 14.83,28.98 v14.61,29.21 | R9.2 13.12,53.76 v13.34,53.97 | v12.7,60.96 R8.2
  Bottom 0.254: JP10.1 JP9.1 JP1.1 JP7.3 JP6.3 JP8.1 10.13,71.93 arc45 9.95,71.86 v9.21,71.12 | JP10.1 25.22,71.93 26.04,71.12 | 26.04,71.12 JP13.2 | 26.04,71.12 29.21,71.12 J7.1 | v25.4,36.83 22.23,36.83 v21.59,37.46 | v48.26,45.08 50.8,45.08 52.07,43.81 60.96,43.81 v62.23,42.54 | JP10.1 22.96,71.93 | 22.23,71.93 v22.23,71.12
  Bottom 0.406: v24.77,21.59 v27.3,19.05 | v12.7,51.43 v12.7,44.45 12.7,42.54 14.61,40.64 v14.61,29.21 | v13.34,53.97 v13.34,57.78 13.34,60.32 v12.7,60.96 v12.7,65.41
+24V
  Top 0.254: R6.1 arc45 54.54,15 53.34,16.19 52.49,16.19 arc-45 52.31,16.27 51.44,17.14 51.44,25.3 arc-45 51.51,25.47 52.39,26.35 arc45 52.52,26.41 U2.10
  Top 0.305: U1.10 62.87,61.59 63.62,60.84 X1.16 71.24,60.84 71.75,60.32 71.75,46.99 73.03,45.72 73.03,38.73 72.39,38.1 LED1.A 71.87,35.04 69.85,33.02 69.85,30.48 67.31,27.94 C6.+ | U2.10 52.7,28.57 53.34,29.21 56.52,29.21 60.33,33.02 62.87,33.02 64.14,34.29 64.14,45.72 66.25,47.84 X1.3
  Top 0.813: R6.1 54.61,15.24 55.88,16.51 58.42,16.51 59.69,15.24 60.96,15.24 | 60.96,15.24 64.77,11.43 D1.C | 60.96,15.24 67.31,21.59 C6.+
A0
  Top 0.508: U$1.10 51.44,45.08 48.26,41.91 46.99,41.91 45.72,40.64 U$2.A0
A1
  Top 0.508: U$1.11 50.16,45.08 48.26,43.18 U$2.A1
A2  (via drill 0.3)
  Top 0.406: U$1.14 v50.16,41.91
  Bottom 0.406: v50.16,41.91 46.35,45.72 U$2.A2
A3
  Top 0.508: U$1.13 47.55,39.93 46.99,39.37 43.18,39.37 41.91,40.64 41.91,46.99 43.18,48.26 U$2.A3
A11
  Top 0.254: U5.1 12.04,56.49 9.53,53.97 7.62,53.97 5.14,51.49 | 5.14,51.49 5.08,51.43 | J3.1 4.63,50.99 5.14,51.49
A12
  Top 0.254: J3.2 3.99,49.07 8.26,53.34 10.16,53.34 12.06,55.24 14.61,55.24 14.86,55.49 U5.3
A21
  Top 0.254: U7.1 16.53,48.24 15.88,48.89 12.06,48.89 10.79,50.16 9.89,50.16 J2.1
A22
  Top 0.254: U7.3 16.26,47.24 15.88,47.62 10.44,47.62 J2.2
A31
  Top 0.254: U8.1 10.14,64.75 J1.1 | J1.1 | J5.1 J1.1
A32
  Top 0.254: J5.2 J1.2 9.16,61.59 9.53,61.59 10.16,62.23 10.16,62.87 11.43,64.14 15.88,64.14 16.26,63.75 U8.3
B11
  Top 0.254: U5.4 15.62,54.99 15.24,54.61 12.7,54.61 10.79,52.7 8.89,52.7 5.71,49.53 5.71,45.72 5.08,45.08 4.08,45.08 J3.4
B12  (via drill 0.3)
  Top 0.254: U5.6 16.53,53.99 v15.88,53.34
  Bottom 0.254: J3.5 4.89,42.99 5.71,43.81 5.71,51.43 6.99,52.7 14.61,52.7 15.24,53.34 v15.88,53.34
B21
  Top 0.254: U7.4 15.49,46.74 15.24,46.99 12.06,46.99 10.16,45.08 9.16,45.08 J2.4
B22
  Top 0.254: U7.6 12.09,45.74 9.34,42.99 J2.5
B31
  Top 0.254: J5.4 J1.4 9.07,57.96 11.43,60.32 11.43,62.87 12.06,63.5 15.24,63.5 15.49,63.25 U8.4
B32
  Top 0.254: U8.6 14.62,62.25 13.97,61.59 13.97,59.69 10.19,55.9 | 10.19,55.9 10.16,55.88 | 10.19,55.9 9.97,55.69 J1.5 J5.5
CE
  Bottom 0.305: M1.3 43.81,12.7 42.55,13.97 40.64,13.97 40.01,14.61 40.01,22.23 36.2,26.04 32.38,26.04 29.21,29.21 U$2.D9
CSN
  Top 0.406: U$2.D10 44.45,22.86 39.37,17.78 39.37,13.97 40.64,12.7 M1.4
DEC1  (via drill 0.3)
  Top 0.254: 17.71,48.96 U7.24 | U5.24 16.58,57.22 v16.51,57.15 v12.7,57.15
  Top 0.305: U7.24 17.07,48.96 v16.51,49.53
  Bottom 0.254: v16.51,49.53 v16.51,57.15 | v12.7,57.15 12.06,57.78 12.06,66.04 10.79,67.31 10.16,67.31 9.53,67.95 9.53,68.58 9.93,68.99 | 9.93,68.99 JP2.2 | JP8.2 10.16,71.12 9.53,70.48 9.53,69.39 9.93,68.99
DEC2  (via drill 0.3)
  Top 0.254: U7.22 18.8,51.18 v19.05,51.43 | U5.22 18.8,58.67 v18.41,59.05
  Bottom 0.254: v19.05,51.43 19.05,52.07 18.41,52.7 18.41,54.57 | JP1.2 17.78,71.12 17.14,70.48 17.14,69.22 17.37,68.99 JP3.2 17.55,68.99 17.14,68.58 17.14,67.31 18.41,66.04 v18.41,59.05 18.41,54.57 | 18.41,54.57 18.41,54.61
DIR1  (via drill 0.3)
  Top 0.254: U8.13 21.02,61.52 v23.5,59.05
  Bottom 0.254: v23.5,59.05 24.13,58.42 U$2.TX0
DIR2
  Top 0.254: U7.13 26.05,45.74 27.3,46.99 27.3,54.61 | 27.3,54.61 28.57,55.88 U$2.RX1 | U5.13 26.69,53.99 27.3,54.61
GND  (via drill 0.3)  (1 unrouted)
  Top 0.254: U7.25 18.37,47.67 arc45 18.2,47.74 U7.2 16.5,47.74 arc-45 16.32,47.81 15.88,48.26 v15.56,48.26 | U7.25 18.37,46.31 arc-45 18.2,46.24 U7.5 15.14,46.24 arc-45 14.96,46.31 v14.92,46.35 | U7.18 20.41,48.24 arc45 20.23,48.17 U7.25 | U5.25 18.37,55.92 arc45 18.2,55.99 U5.2 14.51,55.99 arc45 14.33,55.92 v14.29,55.88 | U5.5 18.2,54.49 arc45 18.37,54.57 U5.25 | U5.18 20.41,56.49 arc45 20.23,56.42 U5.25 | U8.2 18.2,64.25 arc-45 18.37,64.18 U8.25 | U8.25 20.23,64.68 arc-45 20.41,64.75 U8.18 21.46,64.75 arc45 21.64,64.82 21.91,65.09 | U8.5 18.2,62.75 arc45 18.37,62.82 U8.25 | C1.2 v16.51,41.59 | R5.1 v66.36,38.1 | U1.9 62.87,52.17 arc45 62.94,52 v63.5,51.43 | U4.2 58.92,8.49 arc-45 58.75,8.56 U4.9 59.55,10.02 arc-45 59.73,10.09 U4.4
  other vias: 10.16,66.67 11.11,66.04 10.79,70.17 13.34,70.17 15.88,70.17 18.41,70.17 20.95,70.17 52.07,14.92 57.15,13.02 48.9,36.51 50.16,36.51 48.9,35.56 50.16,35.56
  pour Top (isolate 0.406): 0.64,73.03 74.3,73.03 74.3,59.05 74.3,1.27 0.64,1.27
  pour Bottom: 1.27,73.03 74.04,73.03 arc-90 74.3,72.14 74.3,1.27 0.89,1.27 arc-90 0.64,1.52 0.64,72.39
I0  (via drill 0.3)
  Top 0.254: U7.20 19.8,49.64 v20.32,50.16 | U5.20 19.8,57.9 v20.32,58.42
  Bottom 0.254: v20.32,50.16 20.32,53.34 19.68,53.97 19.68,57.78 v20.32,58.42 20.32,66.04 21.59,67.31 22.86,67.31 23.5,67.95 JP12.2 24.36,68.17 24.77,68.58 24.77,70.48 24.13,71.12 JP10.2
I1  (via drill 0.3)
  Top 0.254: U7.21 19.3,50.41 v19.68,50.8 | U5.21 19.3,58.67 v19.68,59.05
  Bottom 0.203: 22.23,68.58 22.23,69.22
  Bottom 0.254: v19.68,50.8 19.68,52.7 19.05,53.34 19.05,58.42 v19.68,59.05 19.68,66.67 20.95,67.95 JP11.2 21.82,68.17 22.23,68.58 | JP9.2 20.32,71.12 19.68,70.48 19.68,69.85 19.93,69.61 arc45 20.11,69.53 21.91,69.53 22.23,69.22
M0  (via drill 0.3)
  Top 0.254: U5.8 18.3,52.59 17.78,52.07 v17.14,52.07 | U7.8 18.3,44.33 v17.78,43.81
  Bottom 0.254: v17.78,43.81 17.14,44.45 v17.14,52.07 17.14,57.78 14.61,60.32 14.61,61.59 13.34,62.87 JP4.1 12.47,68.17 12.06,68.58 12.06,70.48 12.7,71.12 JP6.2
M1  (via drill 0.3)
  Top 0.254: U5.9 18.8,52.45 17.78,51.43 v17.78,50.8 | U7.9 18.8,44.06 v19.05,43.81
  Bottom 0.254: v19.05,43.81 17.78,45.08 v17.78,50.8 17.78,58.42 15.24,60.96 15.24,61.59 13.97,62.87 13.97,66.04 15.47,68.17 JP5.1 15.01,68.17 14.61,68.58 14.61,70.48 15.24,71.12 JP7.2
MISO
  Top 0.406: M1.7 44.45,20.32 46.99,22.86 46.99,27.94 48.26,29.21 48.26,31.75 U$2.D12
MOSI
  Top 0.406: M1.6 43.18,16.51 43.18,20.32 45.72,22.86 45.72,27.94 46.99,29.21 46.99,31.75 45.72,33.02 U$2.D11
N$1
  Top 1.27: SV2.2 SV1.1
N$2
  Top 0.254: U8.7 16.44,61.52 15.88,60.96 R8.1
N$3
  Top 0.508: U1.8 U$1.2
N$4
  Top 0.508: U1.7 U$1.3
N$5
  Top 0.508: U1.6 U$1.4
N$6
  Top 0.508: U1.5 U$1.5
N$7
  Top 0.508: U1.4 U$1.6
N$8
  Top 0.508: U1.3 U$1.7
N$9
  Top 0.508: U1.2 U$1.8
N$10
  Top 0.508: U1.1 U$1.9
N$11
  Top 0.508: U$1.23 61.59,38.73 62.87,37.46 U2.1
N$12
  Top 0.508: U$1.22 60.33,38.73 61.59,37.46 U2.2
N$13
  Top 0.508: U$1.21 59.05,38.73 60.33,37.46 U2.3
N$14
  Top 0.508: U$1.20 57.78,38.73 59.05,37.46 U2.4
N$15
  Top 0.508: U$1.19 56.52,38.73 57.78,37.46 U2.5
N$16
  Top 0.508: U$1.18 55.24,38.73 56.52,37.46 U2.6
N$17
  Top 0.406: R3.1 49.11,11.01 48.26,10.16 48.26,7.62 49.53,6.35 53.34,6.35 54.68,7.69 U4.8
N$18
  Top 0.406: U4.5 55.95,10.09 54.61,11.43 R6.2 R2.2
N$19  (via drill 0.3)
  Top 0.254: U8.22 18.8,66.92 v18.41,67.31
  Bottom 0.254: JP3.1 v18.41,67.31
N$20  (via drill 0.3)
  Top 0.254: U7.17 22.75,47.74 22.86,47.62 | U7.14 22.75,46.24 22.86,46.35 22.86,47.62 | U5.14 22.75,54.49 v22.86,54.61 22.86,55.88 22.75,55.99 | U5.17 22.75,55.99 | U8.14 22.75,62.75 22.86,62.87 | U8.17 22.75,64.25 22.86,64.14 22.86,62.87 | 22.86,62.87 23.5,62.23 23.5,60.32 24.13,59.69 C10.1 24.77,59.47 24.77,57.78 22.98,55.99 22.75,55.99 | 22.86,47.62 v22.86,48.26
  Bottom 0.254: v22.86,54.61 v22.86,48.26
N$21
  Top 0.305: U1.11 61.59,60.32 62.08,59.84 X1.15
N$22
  Top 0.305: U1.12 60.33,60.32 61.81,58.84 X1.14
N$23
  Top 0.305: U1.13 59.05,60.31 61.52,57.84 X1.13
N$24
  Top 0.305: U1.14 57.78,60.32 60.96,57.15 64.14,57.15 66.04,55.24 66.04,52.07 67.27,50.84 X1.6
N$25
  Top 0.305: U1.15 56.52,60.32 60.33,56.51 63.5,56.51 65.41,54.61 65.41,51.43 67,49.84 X1.5
N$26
  Top 0.305: X1.4 66.73,48.84 64.77,50.8 64.77,53.97 62.87,55.88 59.69,55.88 55.24,60.32 U1.16
N$27  (via drill 0.3)
  Top 0.305: X1.7 67.54,51.84 v67.31,52.07 | v55.24,57.78 55.24,59.05 53.98,60.32 U1.17
  Bottom 0.305: v67.31,52.07 66.67,52.07 60.33,58.42 55.88,58.42 v55.24,57.78
N$28  (via drill 0.3)
  Top 0.305: X1.8 67.17,52.84 v66.67,53.34 | v53.34,59.69 52.7,60.32 U1.18
  Bottom 0.305: v66.67,53.34 60.96,59.05 53.98,59.05 v53.34,59.69
N$29
  Top 0.508: U2.8 53.98,37.46 52.7,38.73 U$1.16
N$30  (via drill 0.3)
  Top 0.305: U2.18 62.87,29.84 63.5,30.48 65.41,30.48 66.67,31.75 66.67,33.65 v68.58,35.56 | X1.12 69.53,56.84 v69.85,56.51
  Bottom 0.305: v68.58,35.56 69.85,36.83 v69.85,56.51
N$31  (via drill 0.3)
  Top 0.305: U2.17 61.59,30.48 62.23,31.11 64.77,31.11 66.04,32.38 66.04,34.29 v67.31,35.56 | X1.11 69.17,55.84 v69.22,55.88
  Bottom 0.305: v67.31,35.56 69.22,37.46 v69.22,55.88
N$32
  Top 0.305: U2.16 60.33,30.48 61.59,31.75 64.14,31.75 65.41,33.02 65.41,42.54 66.67,43.81 69.06,43.81 69.85,44.6 69.85,53.97 68.98,54.84 X1.10
N$33
  Top 0.305: X1.9 68.72,53.84 69.22,53.34 69.22,45.08 68.58,44.45 66.04,44.45 64.77,43.18 64.77,33.65 63.5,32.38 60.96,32.38 59.05,30.48 U2.15
N$34
  Top 0.508: U$1.17 53.98,38.73 55.24,37.46 U2.7
N$35  (via drill 0.3)
  Top 0.254: U7.15 21.98,46.74 v22.23,46.99 | U5.15 21.98,54.99 v22.23,55.24 | U8.15 21.98,63.25 v22.23,63.5 | v24.13,64.14 C11.1 C12.1
  Bottom 0.254: v22.23,46.99 v22.23,55.24 22.23,60.96 24.13,62.87 v24.13,64.14 | v22.23,63.5 22.86,63.5 23.5,64.14 v24.13,64.14 | J7.2 32.38,67.95 27.94,67.95 26.04,66.04 25.4,66.04 24.13,64.77 v24.13,64.14
N$36  (via drill 0.3)
  Top 0.406: R3.2 R4.2 | R4.2 54.19,9.31 55.01,8.49 U4.7 | R4.2 v52.07,7.62 | U$5.P$1 54.08,20.96 arc45 53.9,20.88 v53.34,20.32
  Bottom 0.406: v52.07,7.62 52.07,18.95 arc-45 52.14,19.12 v53.34,20.32
N$37
  Top 1.27: S1.1 9.01,10.16 SV2.1
N$38
  Top 0.305: U$3.4 28.45,25.27 29.43,26.25 C2.1
N$39  (via drill 0.3)
  Top 0.305: U$3.3 27.62,21.91 v27.94,21.59 | R1.1 v6.35,40
  Bottom 0.305: v6.35,40 6.35,26.67 8.26,24.77 26.67,24.77 27.94,23.5 v27.94,21.59
N$40  (via drill 0.3)  (1 unrouted)
  Top 0.254: U8.8 18.3,60.84 17.78,60.32 v17.14,60.32 | v14.61,66.04 14.61,66.67 13.34,67.95 v13.34,69.22
  Bottom 0.254: JP4.2 13.34,68.77 | v14.61,66.04 14.61,64.14 15.88,62.87 15.88,61.59 v17.14,60.32
N$41
  Top 0.406: C9.1 57.57,14.82 58.42,13.97 59.69,13.97 62.23,11.43 62.23,10.16 61.36,9.29 U4.3
N$42  (via drill 0.3)  (1 unrouted)
  Top 0.254: U8.9 18.8,60.71 v17.78,59.69 | v15.88,69.22 15.24,68.58 v15.24,66.67
  Bottom 0.254: v17.78,59.69 17.78,60.96 16.51,62.23 16.51,63.5 15.86,64.15 15.88,64.16 15.88,66.04 v15.24,66.67
N$43  (via drill 0.3)
  Top 0.406: U4.1 62.16,7.69 62.86,6.99 | 62.86,6.99 D1.A | U$5.P$2 58.12,19.46 arc45 58.19,19.28 v58.42,19.05 | v62.23,5.08 62.23,6.26 arc-45 62.3,6.43 62.86,6.99
  Bottom 0.406: v58.42,19.05 58.42,9 arc45 58.49,8.82 v62.23,5.08
N$44
  Top 0.305: R5.2 LED1.C
N$45
  Top 0.305: R7.2 LED2.C
N$46
  Top 0.254: U5.7 17.07,53.27 16.51,52.7 R9.1
N$47  (via drill 0.3)
  Top 0.254: U8.24 17.21,65.48 17.14,65.41 13.97,65.41 v12.7,66.67
  Bottom 0.254: JP2.1 11.2,68.17 v12.7,66.67
N$48
  Top 0.254: R10.1 17.23,44.45 U7.7
N$49  (via drill 0.3)
  Top 0.254: U7.19 20.39,48.96 v20.95,49.53 | U5.19 20.39,57.22 v20.95,57.78 | U8.19 20.89,65.48 v20.95,65.41
  Bottom 0.254: v20.95,49.53 20.95,53.97 20.32,54.61 20.32,57.15 v20.95,57.78 v20.95,65.41 20.95,66.04 21.59,66.67 24.13,66.67 25.63,68.17 JP13.1
N$50
  Top 0.305: R11.2 14.19,34.07 15.24,33.02 15.99,33.02 LED3.C
N$51
  Top 0.305: R12.2 16.73,34.07 17.78,33.02 LED4.C
N$52
  Top 0.305: R13.2 LED5.C
N$53  (via drill 0.3)
  Top 0.254: U8.20 19.8,65.94 20.05,66.18 20.46,66.18 21.59,67.31 22.86,67.31 23.5,67.95 v23.5,69.22
  Bottom 0.254: JP12.1 v23.5,69.22
N$54  (via drill 0.3)
  Top 0.254: U8.21 19.3,67.56 v19.68,67.95
  Bottom 0.254: JP11.1 20.09,68.99 19.68,68.58 v19.68,67.95
N$55
  Top 0.305: R14.2 19.05,33.77 LED6.C
N$56
  Top 0.406: LED5.A 22.75,31 24.13,32.38 24.13,34.29 25.4,35.56 U$2.D7
N$57
  Top 0.406: U$2.D8 26.04,33.02 22.86,29.84 20.95,29.84 20.32,30.48 LED6.A
N$83  (via drill 0.3)
  other vias: 66.99,40.64
PULSE  (via drill 0.3)  (1 unrouted)
  Top 0.305: LED2.A 71.87,41.79 71.75,41.91 69.85,41.91 69.22,42.54 v67.94,42.54 | 62.94,48.97 U$1.1 | U$1.1 64.69,48.97 v65.4,48.27 | U$1.1 62.87,46.99 62.23,46.35 v61.59,46.35
  Bottom 0.305: v67.94,42.54 66.67,42.54 65.41,43.81 v65.41,48.26 | U$2.D2 41.27,48.26 42.55,49.53 45.72,49.53 46.99,48.26 46.99,46.99 47.62,46.35 v61.59,46.35
SCK
  Top 0.406: M1.5 45.72,16.51 45.72,20.32 48.26,22.86 48.26,27.94 49.53,29.21 49.53,31.75 46.35,34.92 46.35,37.46 45.72,38.1 U$2.D13
SCL
  Top 0.406: U6.6 32.38,20.96 35.56,24.13 U$2.A5
SDA
  Top 0.406: U6.5 31.82,26.75 33.02,27.94 U$2.A4
STEP1  (via drill 0.3)
  Top 0.254: U8.12 20.3,60.98 v23.5,57.78
  Bottom 0.254: v23.5,57.78 23.5,48.26 26.04,45.72 U$2.D3
STEP2  (via drill 0.3)
  Top 0.254: 20.3,51.48 U5.12 | 20.3,51.48 20.3,51.45 | 20.3,51.48 20.98,50.8 21.59,50.8 23.5,48.89 v23.5,46.35
  Bottom 0.254: v23.5,46.35 23.5,44.45 27.3,40.64 U$2.D5
STEP3
  Top 0.254: U7.12 20.3,44.47 | 20.32,44.45 20.3,44.47 | 20.3,44.47 20.3,43.83 21.59,42.54 23.5,42.54 27.94,38.1 U$2.D6
VCC  (via drill 0.3)
  Top 0.305: C24.1 C23.1 C22.1 C21.1 38.95,70.7 J7.3
  Top 0.406: U4.6 55.48,9.29 53.76,11.01 R4.1 49.96,13.12 C8.1 48.68,13.12 46.99,11.43 46.99,5.12 C7.+ | S1.2 3.17,13.97 1.52,15.62 1.52,69.72 3.71,71.9 36.05,71.9 J7.3
  Top 0.813: U3.1 19.9,22.86 C5.1
  Top 1.27: S1.2 11.43,13.97 17.3,19.84 U3.1 | 46.99,5.12 48.22,5.12 v50.16,3.18
  Bottom 1.27: S1.2 17.14,13.97 22.23,8.89 29.21,8.89 35.56,2.54 49.53,2.54 v50.16,3.18

### Text on the board
bPlace: Beeclust - Multi Robot Systems Lab | Main Board v1.0 | Open Source | Hardware | #KarpeDiem